# Altium project PCB_SMAALL.PrjPcb
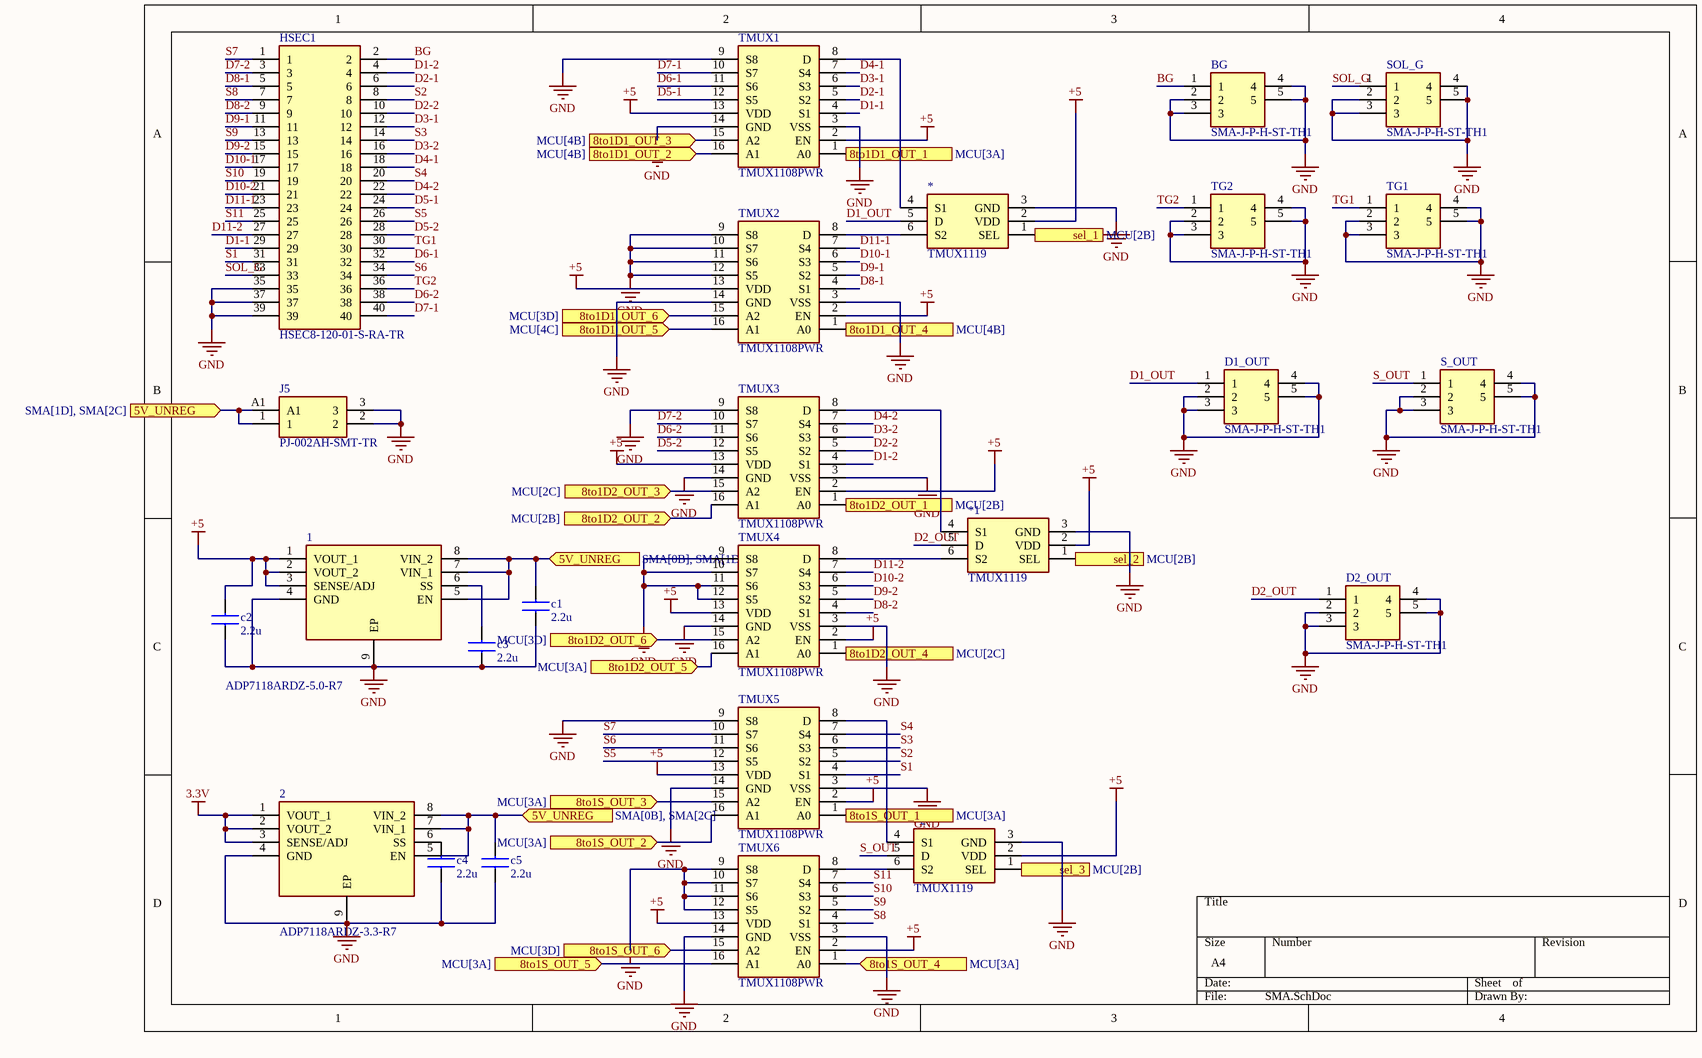
[diagram p0: SMA.SchDoc]
2 sheets, 31 parts. Net scope: flat (ports and power ports of the same name join across sheets).
Board file: Board.PcbDoc
Sheets:
  SMA.SchDoc
  MCU.SchDoc

## Sheet SMA.SchDoc
size A4; SheetNumber: 1; SheetTotal: 2

### Parts
1  ADP7118ARDZ-5.0-R7  [ADP7118ARDZ-5.0-R7]
2  ADP7118ARDZ-3.3-R7  [ADP7118ARDZ-5.0-R7]
*1  TMUX1119  [TMUX1119DBVR]
*2  TMUX1119  [TMUX1119DBVR]
*3  TMUX1119  [TMUX1119DBVR]
BG  SMA-J-P-H-ST-TH1  [SMAJPHSTTH1]
c1  2.2u  [0805X7R106KT1AT]
c2  2.2u  [0805X7R106KT1AT]
c3  2.2u  [0805X7R106KT1AT]
c4  2.2u  [0805X7R106KT1AT]
c5  2.2u  [0805X7R106KT1AT]
D1_OUT  SMA-J-P-H-ST-TH1  [SMAJPHSTTH1]
D2_OUT  SMA-J-P-H-ST-TH1  [SMAJPHSTTH1]
HSEC1  HSEC8-120-01-S-RA-TR  [SAMTEC_HSEC8-120-01-L-RA]
J5  PJ-002AH-SMT-TR  [PWRPJ]
S_OUT  SMA-J-P-H-ST-TH1  [SMAJPHSTTH1]
SOL_G  SMA-J-P-H-ST-TH1  [SMAJPHSTTH1]
TG1  SMA-J-P-H-ST-TH1  [SMAJPHSTTH1]
TG2  SMA-J-P-H-ST-TH1  [SMAJPHSTTH1]
TMUX1  TMUX1108PWR  [TMUX1108PWR]
TMUX2  TMUX1108PWR  [TMUX1108PWR]
TMUX3  TMUX1108PWR  [TMUX1108PWR]
TMUX4  TMUX1108PWR  [TMUX1108PWR]
TMUX5  TMUX1108PWR  [TMUX1108PWR]
TMUX6  TMUX1108PWR  [TMUX1108PWR]

### Ports
5V_UNREG (in, see SMA[0B], SMA[1D]), 5V_UNREG (in, see SMA[0B], SMA[2C]), 5V_UNREG (in, see SMA[1D], SMA[2C]), 8to1D1_OUT_1 (in, see MCU[3A]), 8to1D1_OUT_2 (in, see MCU[4B]), 8to1D1_OUT_3 (in, see MCU[4B]), 8to1D1_OUT_4 (in, see MCU[4B]), 8to1D1_OUT_5 (in, see MCU[4C]), 8to1D1_OUT_6 (in, see MCU[3D]), 8to1D2_OUT_1 (in, see MCU[2B]), 8to1D2_OUT_2 (in, see MCU[2B]), 8to1D2_OUT_3 (in, see MCU[2C]), 8to1D2_OUT_4 (in, see MCU[2C]), 8to1D2_OUT_5 (in, see MCU[3A]), 8to1D2_OUT_6 (in, see MCU[3D]), 8to1S_OUT_1 (in, see MCU[3A]), 8to1S_OUT_2 (in, see MCU[3A]), 8to1S_OUT_3 (in, see MCU[3A]), 8to1S_OUT_4 (in, see MCU[3A]), 8to1S_OUT_5 (in, see MCU[3A]), 8to1S_OUT_6 (in, see MCU[3D]), sel_1 (in, see MCU[2B]), sel_2 (in, see MCU[2B]), sel_3 (in, see MCU[2B])

### Nets
3.3V: 2.1(VOUT_1) 2.2(VOUT_2) 2.3(SENSE/ADJ)
+5: 1.1(VOUT_1) 1.2(VOUT_2) 1.3(SENSE/ADJ) *1.2(VDD) *2.2(VDD) *3.2(VDD) c2.2 TMUX1.2(EN) TMUX1.13(VDD) TMUX2.2(EN) TMUX2.13(VDD) TMUX3.2(EN) TMUX3.13(VDD) TMUX4.2(EN) TMUX4.13(VDD) TMUX5.2(EN) TMUX5.13(VDD) TMUX6.2(EN) TMUX6.13(VDD)
GND: 1.4(GND) 1.9(EP) 2.4(GND) 2.9(EP) *1.3(GND) *2.3(GND) *3.3(GND) BG.2 BG.3 BG.4 BG.5 c1.1 c2.1 c3.1 c4.1 c5.1 D1_OUT.2 D1_OUT.3 D1_OUT.4 D1_OUT.5 D2_OUT.2 D2_OUT.3 D2_OUT.4 D2_OUT.5 HSEC1.35 HSEC1.37 HSEC1.39 J5.2 J5.3 S_OUT.2 S_OUT.3 S_OUT.4 S_OUT.5 SOL_G.2 SOL_G.3 SOL_G.4 SOL_G.5 TG1.2 TG1.3 TG1.4 TG1.5 TG2.2 TG2.3 TG2.4 TG2.5 TMUX1.3(VSS) TMUX1.9(S8) TMUX1.14(GND) TMUX2.3(VSS) TMUX2.9(S8) TMUX2.10(S7) TMUX2.11(S6) TMUX2.12(S5) TMUX2.14(GND) TMUX3.3(VSS) TMUX3.9(S8) TMUX3.14(GND) TMUX4.3(VSS) TMUX4.9(S8) TMUX4.10(S7) TMUX4.11(S6) TMUX4.12(S5) TMUX4.14(GND) TMUX5.3(VSS) TMUX5.9(S8) TMUX5.14(GND) TMUX6.3(VSS) TMUX6.9(S8) TMUX6.10(S7) TMUX6.11(S6) TMUX6.12(S5) TMUX6.14(GND)
BG: BG.1 HSEC1.2
D1-1: HSEC1.29 TMUX1.4(S1)
D1-2: HSEC1.4 TMUX3.4(S1)
D1_OUT: *3.5(D) D1_OUT.1
D2-1: HSEC1.6 TMUX1.5(S2)
D2-2: HSEC1.10 TMUX3.5(S2)
D2_OUT: *1.5(D) D2_OUT.1
D3-1: HSEC1.12 TMUX1.6(S3)
D3-2: HSEC1.16 TMUX3.6(S3)
D4-1: HSEC1.18 TMUX1.7(S4)
D4-2: HSEC1.22 TMUX3.7(S4)
D5-1: HSEC1.24 TMUX1.12(S5)
D5-2: HSEC1.28 TMUX3.12(S5)
D6-1: HSEC1.32 TMUX1.11(S6)
D6-2: HSEC1.38 TMUX3.11(S6)
D7-1: HSEC1.40 TMUX1.10(S7)
D7-2: HSEC1.3 TMUX3.10(S7)
D8-1: HSEC1.5 TMUX2.4(S1)
D8-2: HSEC1.9 TMUX4.4(S1)
D9-1: HSEC1.11 TMUX2.5(S2)
D9-2: HSEC1.15 TMUX4.5(S2)
D10-1: HSEC1.17 TMUX2.6(S3)
D10-2: HSEC1.21 TMUX4.6(S3)
D11-1: HSEC1.23 TMUX2.7(S4)
D11-2: HSEC1.27 TMUX4.7(S4)
S1: HSEC1.31 TMUX5.4(S1)
S2: HSEC1.8 TMUX5.5(S2)
S3: HSEC1.14 TMUX5.6(S3)
S4: HSEC1.20 TMUX5.7(S4)
S5: HSEC1.26 TMUX5.12(S5)
S6: HSEC1.34 TMUX5.11(S6)
S7: HSEC1.1 TMUX5.10(S7)
S8: HSEC1.7 TMUX6.4(S1)
S9: HSEC1.13 TMUX6.5(S2)
S10: HSEC1.19 TMUX6.6(S3)
S11: HSEC1.25 TMUX6.7(S4)
S_OUT: *2.5(D) S_OUT.1
SOL_G: HSEC1.33 SOL_G.1
TG1: HSEC1.30 TG1.1
TG2: HSEC1.36 TG2.1
Net1_5: 1.5(EN) 1.7(VIN_1) 1.8(VIN_2) 2.5(EN) 2.7(VIN_1) 2.8(VIN_2) c1.2 c5.2 J5.1 J5.A1 ; port 5V_UNREG
Net1_6: 1.6(SS) c3.2
Net2_6: 2.6(SS) c4.2
Net*1_1: *1.1(SEL) ; port sel_2
Net*1_4: *1.4(S1) TMUX3.8(D)
Net*1_6: *1.6(S2) TMUX4.8(D)
Net*2_1: *2.1(SEL) ; port sel_3
Net*2_4: *2.4(S1) TMUX5.8(D)
Net*2_6: *2.6(S2) TMUX6.8(D)
Net*3_1: *3.1(SEL) ; port sel_1
Net*3_4: *3.4(S1) TMUX1.8(D)
Net*3_6: *3.6(S2) TMUX2.8(D)
NetTMUX1_1: TMUX1.1(A0) ; port 8to1D1_OUT_1
NetTMUX1_15: TMUX1.15(A2) ; port 8to1D1_OUT_3
NetTMUX1_16: TMUX1.16(A1) ; port 8to1D1_OUT_2
NetTMUX2_1: TMUX2.1(A0) ; port 8to1D1_OUT_4
NetTMUX2_15: TMUX2.15(A2) ; port 8to1D1_OUT_6
NetTMUX2_16: TMUX2.16(A1) ; port 8to1D1_OUT_5
NetTMUX3_1: TMUX3.1(A0) ; port 8to1D2_OUT_1
NetTMUX3_15: TMUX3.15(A2) ; port 8to1D2_OUT_3
NetTMUX3_16: TMUX3.16(A1) ; port 8to1D2_OUT_2
NetTMUX4_1: TMUX4.1(A0) ; port 8to1D2_OUT_4
NetTMUX4_15: TMUX4.15(A2) ; port 8to1D2_OUT_6
NetTMUX4_16: TMUX4.16(A1) ; port 8to1D2_OUT_5
NetTMUX5_1: TMUX5.1(A0) ; port 8to1S_OUT_1
NetTMUX5_15: TMUX5.15(A2) ; port 8to1S_OUT_3
NetTMUX5_16: TMUX5.16(A1) ; port 8to1S_OUT_2
NetTMUX6_1: TMUX6.1(A0) ; port 8to1S_OUT_4
NetTMUX6_15: TMUX6.15(A2) ; port 8to1S_OUT_6
NetTMUX6_16: TMUX6.16(A1) ; port 8to1S_OUT_5

### Library data of the parts
2 = ADP7118ARDZ-5.0-R7
BG D1_OUT D2_OUT S_OUT SOL_G TG1 TG2 = SMA-J-P-H-ST-TH1: SAMTEC - SMA-J-P-H-ST-TH1 - RF COAXIAL, SMA JACK, 50 OHM, PCB; Geometry.Height: 9.55mm; Mouser Part Number: 200-SMAJPHSTTH1; Mouser Price/Stock: https://www.mouser.co.uk/ProductDetail/Samtec/SMA-J-P-H-ST-TH1?qs=bkXRl3BLxbHdaAB2Qwy6zw%3D%3D; Manufacturer_Name: SAMTEC; Manufacturer_Part_Number: SMA-J-P-H-ST-TH1; Datasheet Link: http://suddendocs.samtec.com/prints/sma-j-p-x-st-th1-mkt.pdf
c1-c5 = capacitor
J5 = Powerinput

## Sheet MCU.SchDoc
size A4; SheetNumber: 5; SheetTotal: 5
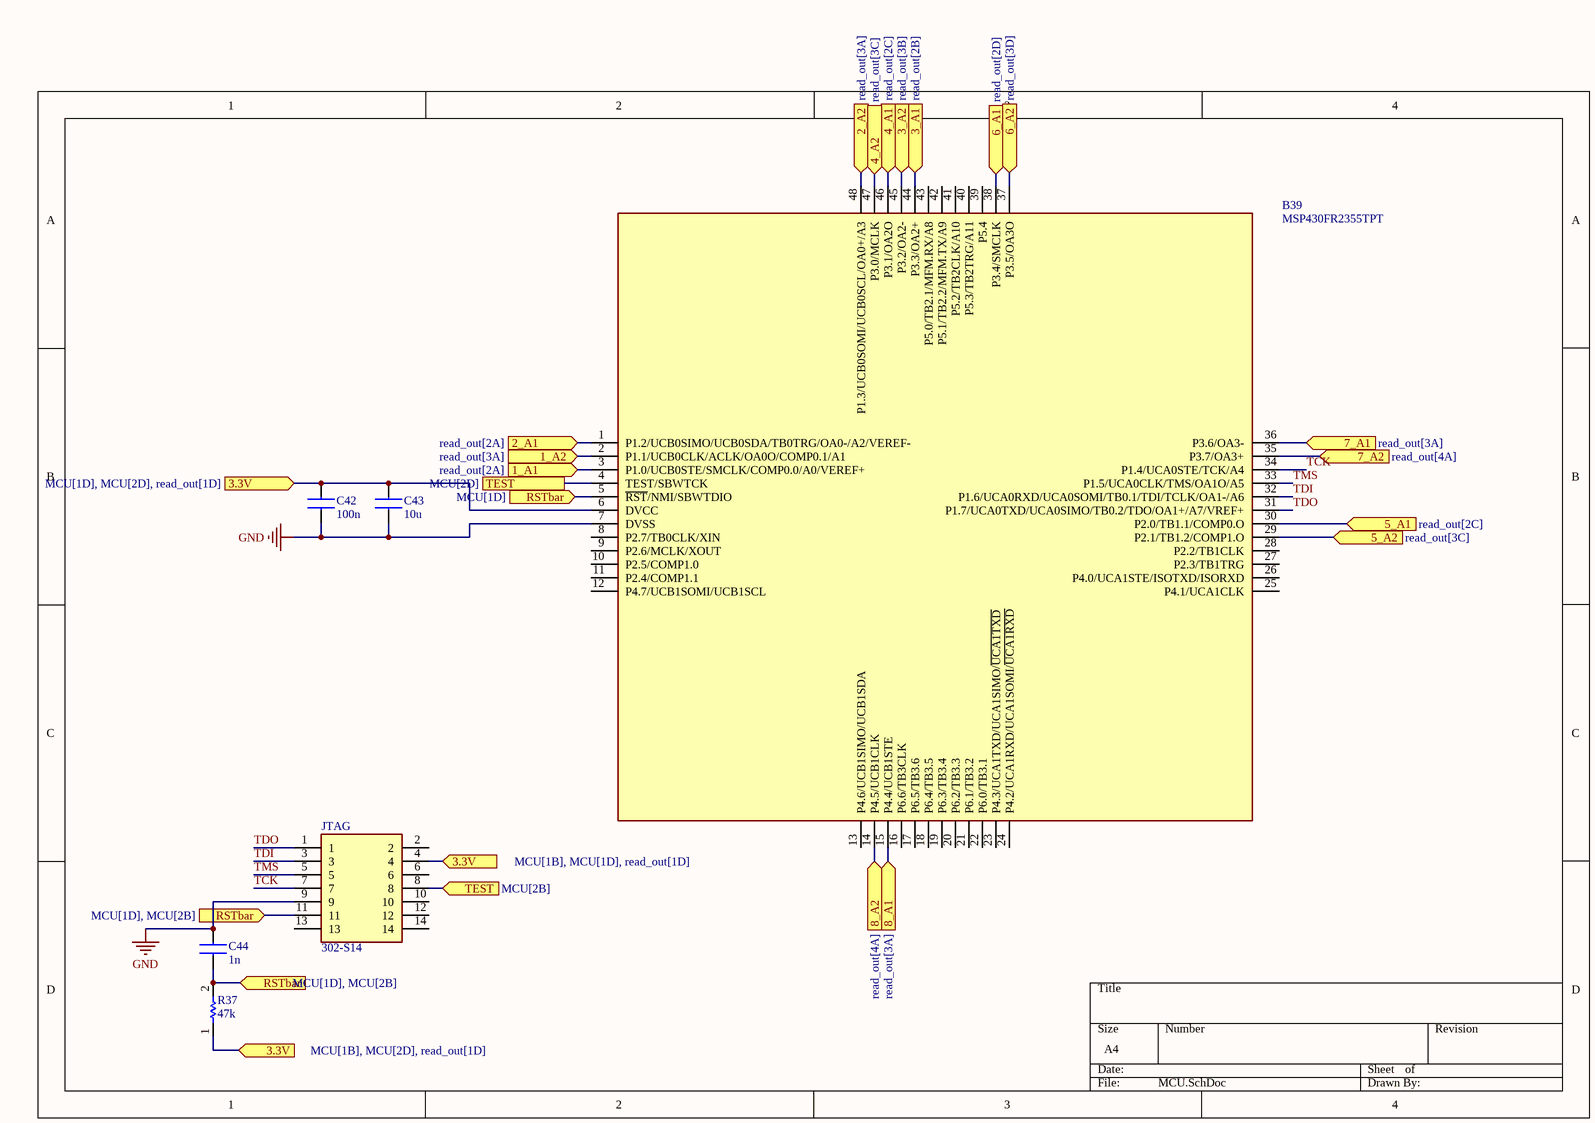
[diagram p1: MCU.SchDoc]

### Parts
B39  MSP430FR2355TPT  [QFP50P900X900X160-48N]
C42  100n  [0805X7R106KT1AT]
C43  10u  [0805X7R106KT1AT]
C44  1n  [0805X7R106KT1AT]
JTAG  302-S14  [CONN_7024614xx_MOL]
R37  47k  [CR0805-FX-1543ELF]

### Ports
1_A1 (in, see read_out[2A]), 1_A2 (in, see read_out[3A]), 2_A1 (in, see read_out[2A]), 2_A2 (in, see read_out[3A]), 3.3V (in, see MCU[1B], MCU[1D], read_out[1D]), 3.3V (in, see MCU[1B], MCU[2D], read_out[1D]), 3.3V (in, see MCU[1D], MCU[2D], read_out[1D]), 3_A1 (in, see read_out[2B]), 3_A2 (in, see read_out[3B]), 4_A1 (in, see read_out[2C]), 4_A2 (in, see read_out[3C]), 5_A1 (in, see read_out[2C]), 5_A2 (in, see read_out[3C]), 6_A1 (in, see read_out[2D]), 6_A2 (in, see read_out[3D]), 7_A1 (in, see read_out[3A]), 7_A2 (in, see read_out[4A]), 8_A1 (in, see read_out[3A]), 8_A2 (in, see read_out[4A]), RSTbar (in, see MCU[1D]), RSTbar (in, see MCU[1D], MCU[2B]), TEST (in, see MCU[2B]), TEST (see MCU[2D])

### Nets
GND: B39.7(DVSS) C42.2 C43.2 C44.2 JTAG.9
TCK: B39.34(P1.4/UCA0STE/TCK/A4) JTAG.7
TDI: B39.32(P1.6/UCA0RXD/UCA0SOMI/TB0.1/TDI/TCLK/OA1-/A6) JTAG.3
TDO: B39.31(P1.7/UCA0TXD/UCA0SIMO/TB0.2/TDO/OA1+/A7/VREF+) JTAG.1
TMS: B39.33(P1.5/UCA0CLK/TMS/OA1O/A5) JTAG.5
NetB39_1: B39.1(P1.2/UCB0SIMO/UCB0SDA/TB0TRG/OA0-/A2/VEREF-) ; port 2_A1
NetB39_2: B39.2(P1.1/UCB0CLK/ACLK/OA0O/COMP0.1/A1) ; port 1_A2
NetB39_3: B39.3(P1.0/UCB0STE/SMCLK/COMP0.0/A0/VEREF+) ; port 1_A1
NetB39_4: B39.4(TEST/SBWTCK) JTAG.8 ; port TEST
NetB39_5: B39.5(~{RST}/NMI/SBWTDIO) C44.1 JTAG.11 R37.2 ; port RSTbar
NetB39_6: B39.6(DVCC) C42.1 C43.1 JTAG.4 R37.1 ; port 3.3V
NetB39_14: B39.14(P4.5/UCB1CLK) ; port 8_A2
NetB39_15: B39.15(P4.4/UCB1STE) ; port 8_A1
NetB39_29: B39.29(P2.1/TB1.2/COMP1.O) ; port 5_A2
NetB39_30: B39.30(P2.0/TB1.1/COMP0.O) ; port 5_A1
NetB39_35: B39.35(P3.7/OA3+) ; port 7_A2
NetB39_36: B39.36(P3.6/OA3-) ; port 7_A1
NetB39_37: B39.37(P3.5/OA3O) ; port 6_A2
NetB39_38: B39.38(P3.4/SMCLK) ; port 6_A1
NetB39_44: B39.44(P3.3/OA2+) ; port 3_A1
NetB39_45: B39.45(P3.2/OA2-) ; port 3_A2
NetB39_46: B39.46(P3.1/OA2O) ; port 4_A1
NetB39_47: B39.47(P3.0/MCLK) ; port 4_A2
NetB39_48: B39.48(P1.3/UCB0SOMI/UCB0SCL/OA0+/A3) ; port 2_A2

Not connected (* = marked no-connect by the designer): B39 8(P2.7/TB0CLK/XIN) 9(P2.6/MCLK/XOUT) 10(P2.5/COMP1.0) 11(P2.4/COMP1.1) 12(P4.7/UCB1SOMI/UCB1SCL) 13(P4.6/UCB1SIMO/UCB1SDA) 16(P6.6/TB3CLK) 17(P6.5/TB3.6) 18(P6.4/TB3.5) 19(P6.3/TB3.4) 20(P6.2/TB3.3) 21(P6.1/TB3.2) 22(P6.0/TB3.1) 23(P4.3/UCA1TXD/UCA1SIMO/~{UCA1TXD}) 24(P4.2/UCA1RXD/UCA1SOMI/~{UCA1RXD}) 25(P4.1/UCA1CLK) 26(P4.0/UCA1STE/ISOTXD/ISORXD) 27(P2.3/TB1TRG) 28(P2.2/TB1CLK) 39(P5.4) 40(P5.3/TB2TRG/A11) 41(P5.2/TB2CLK/A10) 42(P5.1/TB2.2/MFM.TX/A9) 43(P5.0/TB2.1/MFM.RX/A8); JTAG 2 6 10 12 13 14

### Library data of the parts
B39 = MSP430FR2355TPT: 16-bit Microcontrollers - MCU 24MHz 105C ULP Microcontroller With 32 KB FRAM, 4 KB SRAM, 44 IO, 12-bit ADC, 12-bit DACs, OpAmp/PGA 48-LQFP -40 to 105; Manufacturer_Name: Texas Instruments; Geometry.Height: 1.6mm; Mouser Part Number: 595-MSP430FR2355TPT; Mouser Price/Stock: https://www.mouser.co.uk/ProductDetail/Texas-Instruments/MSP430FR2355TPT?qs=gTYE2QTfZfTjQOKK%2F%2Fw59A%3D%3D; Manufacturer_Part_Number: MSP430FR2355TPT; Datasheet Link: https://datasheet.datasheetarchive.com/originals/distributors/DKDS41/DSANUWW0029426.pdf
C42-C44 = capacitor
JTAG = JTAG
R37 = resistor

## Nets that join several sheets
GND: SMA (72 pins), MCU (5 pins)